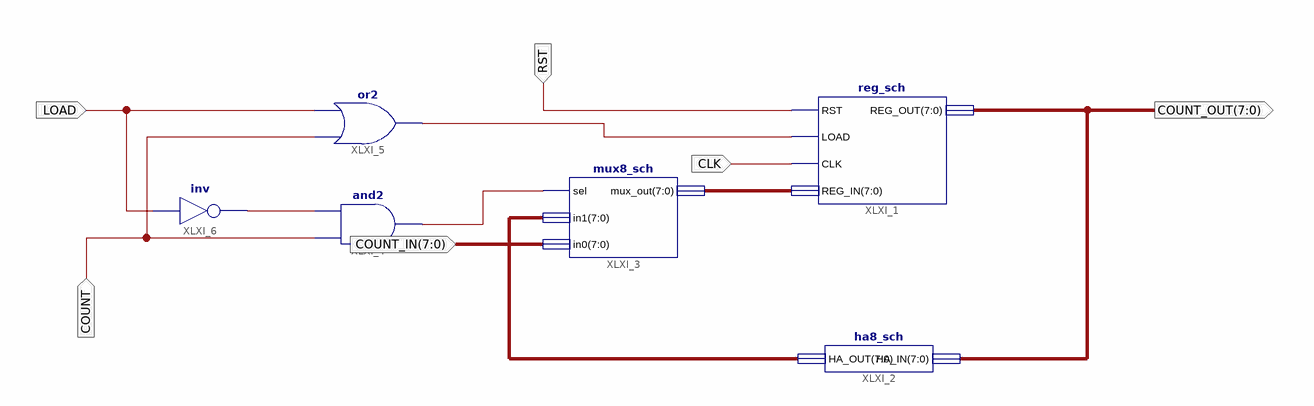
[diagram p0: schematic sheet 1]
// Xilinx ISE schematic counter_sch.sch (spartan3e) as structural Verilog: 6 symbols, 6 ports
module counter_sch (
  input  RST,
  input  CLK,
  input  LOAD,
  input  COUNT,
  input  [7:0] COUNT_IN,
  output [7:0] COUNT_OUT
);

  wire XLXN_1, XLXN_2, XLXN_9;
  wire [7:0] XLXN_11, XLXN_12;

  reg_sch XLXI_1 (.RST(RST), .LOAD(XLXN_2), .CLK(CLK), .REG_IN(XLXN_11), .REG_OUT(COUNT_OUT));
  ha8_sch XLXI_2 (.HA_IN(COUNT_OUT), .HA_OUT(XLXN_12));
  mux8_sch XLXI_3 (.sel(XLXN_1), .in1(XLXN_12), .in0(COUNT_IN), .mux_out(XLXN_11));
  and XLXI_4 (XLXN_1, COUNT, XLXN_9);
  or XLXI_5 (XLXN_2, COUNT, LOAD);
  not XLXI_6 (XLXN_9, LOAD);
endmodule
